# Altium schematic sheet sat-kim2.SchDoc
size A4; Organization: Arribada Initiative; Address1: https://github.com/arribada; Address2: contact@arribada.org; Address3: arribada.org; Address4: UK - Portsmouth; DocumentNumber: 12; SheetNumber: 12; SheetTotal: 13
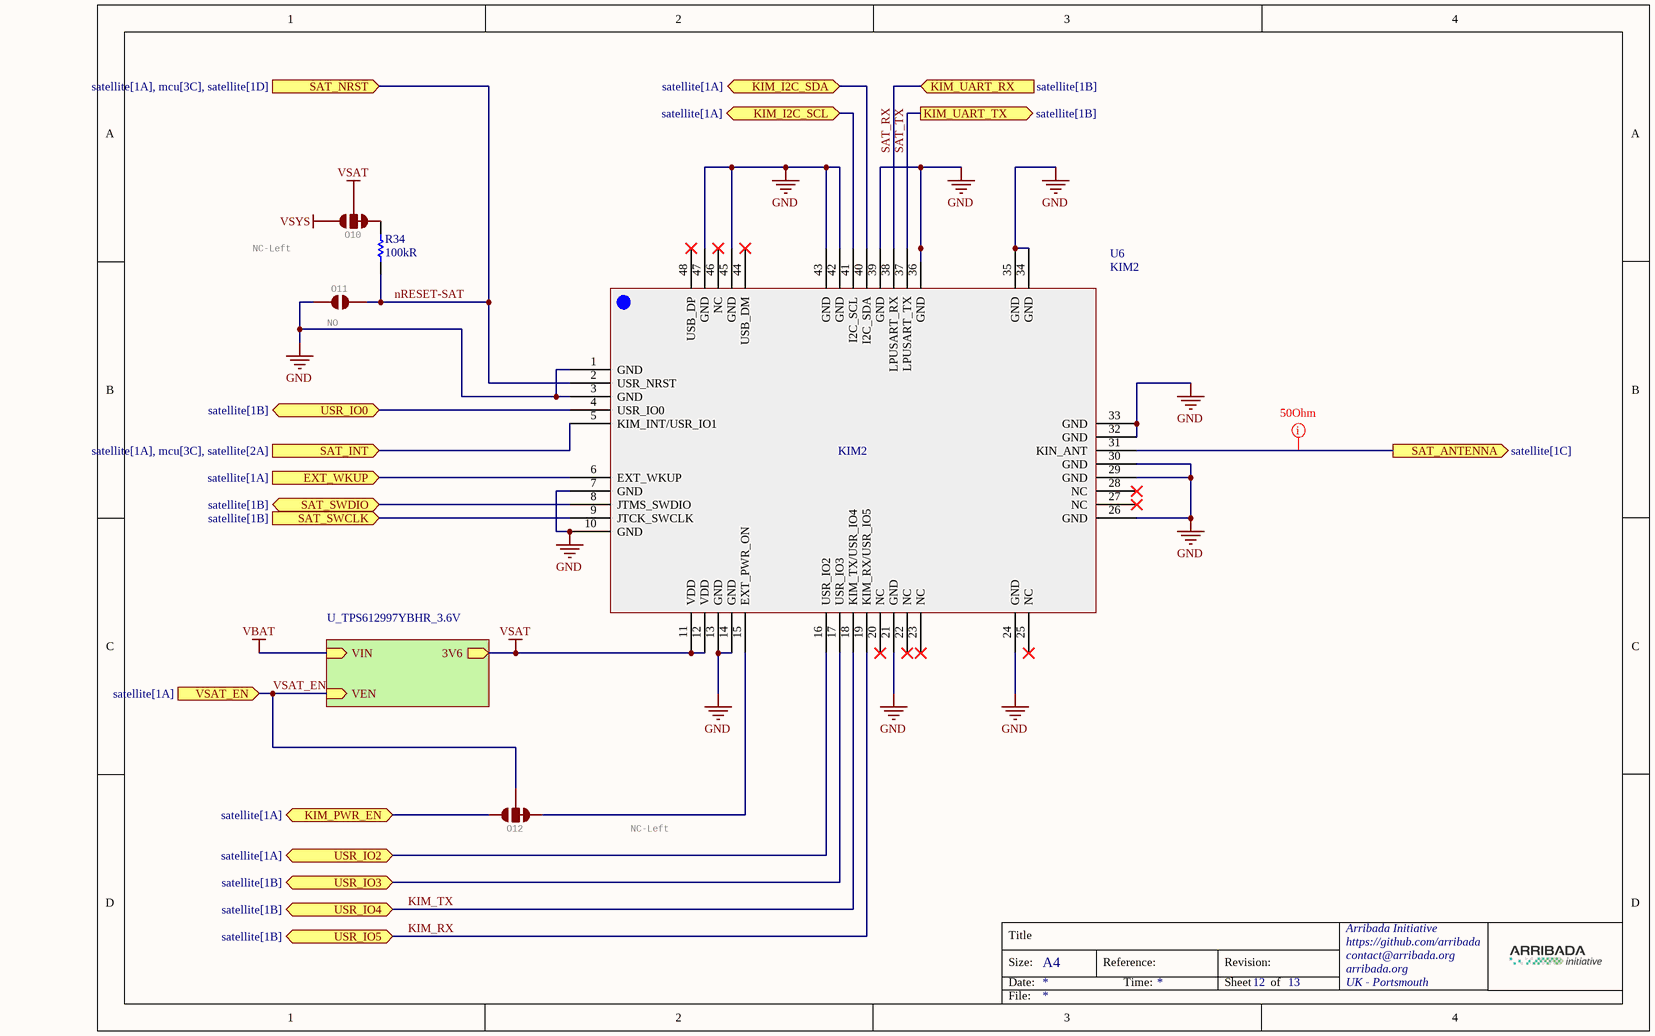
[diagram p0: sat-kim2.SchDoc]

## Parts
O10  NC-Left  [SMT-JUMPER_3_2-NCLEFT_TRACE_SILK]  (net tie, no BOM)
O11  NO  [SMT-JUMPER_2_NO_TRACE_SILK]  (net tie, no BOM)
O12  NC-Left  [SMT-JUMPER_3_2-NCLEFT_TRACE_SILK]  (net tie, no BOM)
R34  value 100kR  [RESC0603X28N]  (hidden comment: CRCW0201100KJNED)
U6  KIM2  [KIM2 FOOTPRINT]

## Sub-sheets
U_TPS612997YBHR_3.6V = TPS612997YBHR_3.6V_lowIQ_1.9A: VIN (in), VEN (in), 3V6 (out)

## Ports
EXT_WKUP (in, see satellite[1A]), KIM_I2C_SCL (bidir, see satellite[1A]), KIM_I2C_SDA (bidir, see satellite[1A]), KIM_PWR_EN (bidir, see satellite[1A]), KIM_UART_RX (in, see satellite[1B]), KIM_UART_TX (out, see satellite[1B]), SAT_ANTENNA (out, see satellite[1C]), SAT_INT (in, see satellite[1A], mcu[3C], satellite[2A]), SAT_NRST (in, see satellite[1A], mcu[3C], satellite[1D]), SAT_SWCLK (in, see satellite[1B]), SAT_SWDIO (bidir, see satellite[1B]), USR_IO0 (bidir, see satellite[1B]), USR_IO2 (bidir, see satellite[1A]), USR_IO3 (bidir, see satellite[1B]), USR_IO4 (bidir, see satellite[1B]), USR_IO5 (bidir, see satellite[1B]), VSAT_EN (in, see satellite[1A])

## Nets
GND: O11.1 U6.1(GND) U6.3(GND) U6.7(GND) U6.10(GND) U6.13(GND) U6.14(GND) U6.21(GND) U6.24(GND) U6.26(GND) U6.29(GND) U6.30(GND) U6.32(GND) U6.33(GND) U6.34(GND) U6.35(GND) U6.36(GND) U6.39(GND) U6.42(GND) U6.43(GND) U6.45(GND) U6.47(GND)
VBAT: sheet U_TPS612997YBHR_3.6V/VIN
VSAT: O10.2 U6.11(VDD) U6.12(VDD) ; sheet U_TPS612997YBHR_3.6V/3V6
VSYS: O10.3
EXT_WKUP: U6.6(EXT_WKUP) ; port EXT_WKUP
KIM_I2C_SCL: U6.41(I2C_SCL) ; port KIM_I2C_SCL
KIM_I2C_SDA: U6.40(I2C_SDA) ; port KIM_I2C_SDA
KIM_PWR_EN: O12.3 ; port KIM_PWR_EN
KIM_RX: U6.19(KIM_RX/USR_IO5) ; port USR_IO5
KIM_TX: U6.18(KIM_TX/USR_IO4) ; port USR_IO4
nRESET-SAT: O11.2 R34.1 U6.2(USR_NRST) ; port SAT_NRST
SAT_ANTENNA: U6.31(KIN_ANT) ; port SAT_ANTENNA
SAT_INT: U6.5(KIM_INT/USR_IO1) ; port SAT_INT
SAT_RX: U6.38(LPUSART_RX) ; port KIM_UART_RX
SAT_SWCLK: U6.9(JTCK_SWCLK) ; port SAT_SWCLK
SAT_SWDIO: U6.8(JTMS_SWDIO) ; port SAT_SWDIO
SAT_TX: U6.37(LPUSART_TX) ; port KIM_UART_TX
USR_IO0: U6.4(USR_IO0) ; port USR_IO0
USR_IO2: U6.16(USR_IO2) ; port USR_IO2
USR_IO3: U6.17(USR_IO3) ; port USR_IO3
VSAT_EN: O12.2 ; port VSAT_EN, sheet U_TPS612997YBHR_3.6V/VEN
NetO10_1: O10.1 R34.2
NetO12_1: O12.1 U6.15(EXT_PWR_ON)

Not connected (* = marked no-connect by the designer): U6 20(NC)* 22(NC)* 23(NC)* 25(NC)* 27(NC)* 28(NC)* 44(USB_DM)* 46(NC)* 48(USB_DP)*

## Layout directives
rule Impedance Constraint [Min = 48.00    Max = 52.00    ]; net class 50R_Net: SAT_ANTENNA

## Notes on the sheet
- Title
- Size:
- Date:
- A4
- Reference:
- Time:
- Revision:
- Sheet
- of
- File:

## Library data of the parts
O10 O12 = JUMPER-SMT_3_2-NCLEFT_TRACE_SILK: Normally opened lefttrace jumper (1 of 2 connections)    This jumper has a trace between left pad pads so they are normally closed (NC). Use a razor knife to open the connection(s). For best results follow the IPC guidelines for cutting traces: Cutout at least 0.063 mm (0.005 in).  Remove all loose material to clean up the cut area.  Seal the cut with an approved epoxy.       Reapply solder to reclose the connection(s).; GateName_1: G$1; SymbolName_1: SMT-JUMPER_3_2-NC_TRACE; DeviceName: _SILK; DeviceSetName: JUMPER-SMT_3_2-NC_TRACE; LibraryName: SparkFun-Jumpers
O11 = JUMPER-SMT_2_NO_TRACE_SILK_1: Normally opened trace jumper / This jumper has no trace between two pads so it's normally closed (NO).; GateName_1: G$1; SymbolName_1: SMT-JUMPER_2_NC_TRACE; DeviceName: _SILK; DeviceSetName: JUMPER-SMT_2_NC_TRACE; LibraryName: SparkFun-Jumpers
R34 = CRCW0201100KJNED: Thick Film Resistors - SMD 1/20watt 100Kohms 5% 200ppm; Manufacturer_Name: Vishay; Datasheet Link: http://www.vishay.com/docs/20035/dcrcwe3.pdf; Height: 0.28mm; Manufacturer_Part_Number: CRCW0201100KJNED; Mouser Part Number: 71-CRCW0201100KJNED; Mouser Price/Stock: https://www.mouser.co.uk/ProductDetail/Vishay-Dale/CRCW0201100KJNED?qs=IQLUlsvFoXu8A8gHIw6owA%3D%3D; Arrow Part Number: CRCW0201100KJNED; Arrow Price/Stock: https://www.arrow.com/en/products/crcw0201100kjned/vishay
U6 = KIM2: KIM2 Module 48 pins 1.27mm pitch 36.6 x 25.4 x 5mm; Manufacturer: Kineis; Tolerance: -30 /  +55°C; Rating: 3.3-5V; BOI: SMD48 36.6x25.4x5mm; DESIG: KIMFLEX Module 48 pins 1.27mm pitch 36.6 x 25.4 x 5mm; VAL: KIM2; K P/N: -; Manufacturer P/N: KIM2; Supplier: Kineis; Supplier P/N: KIMFLEX